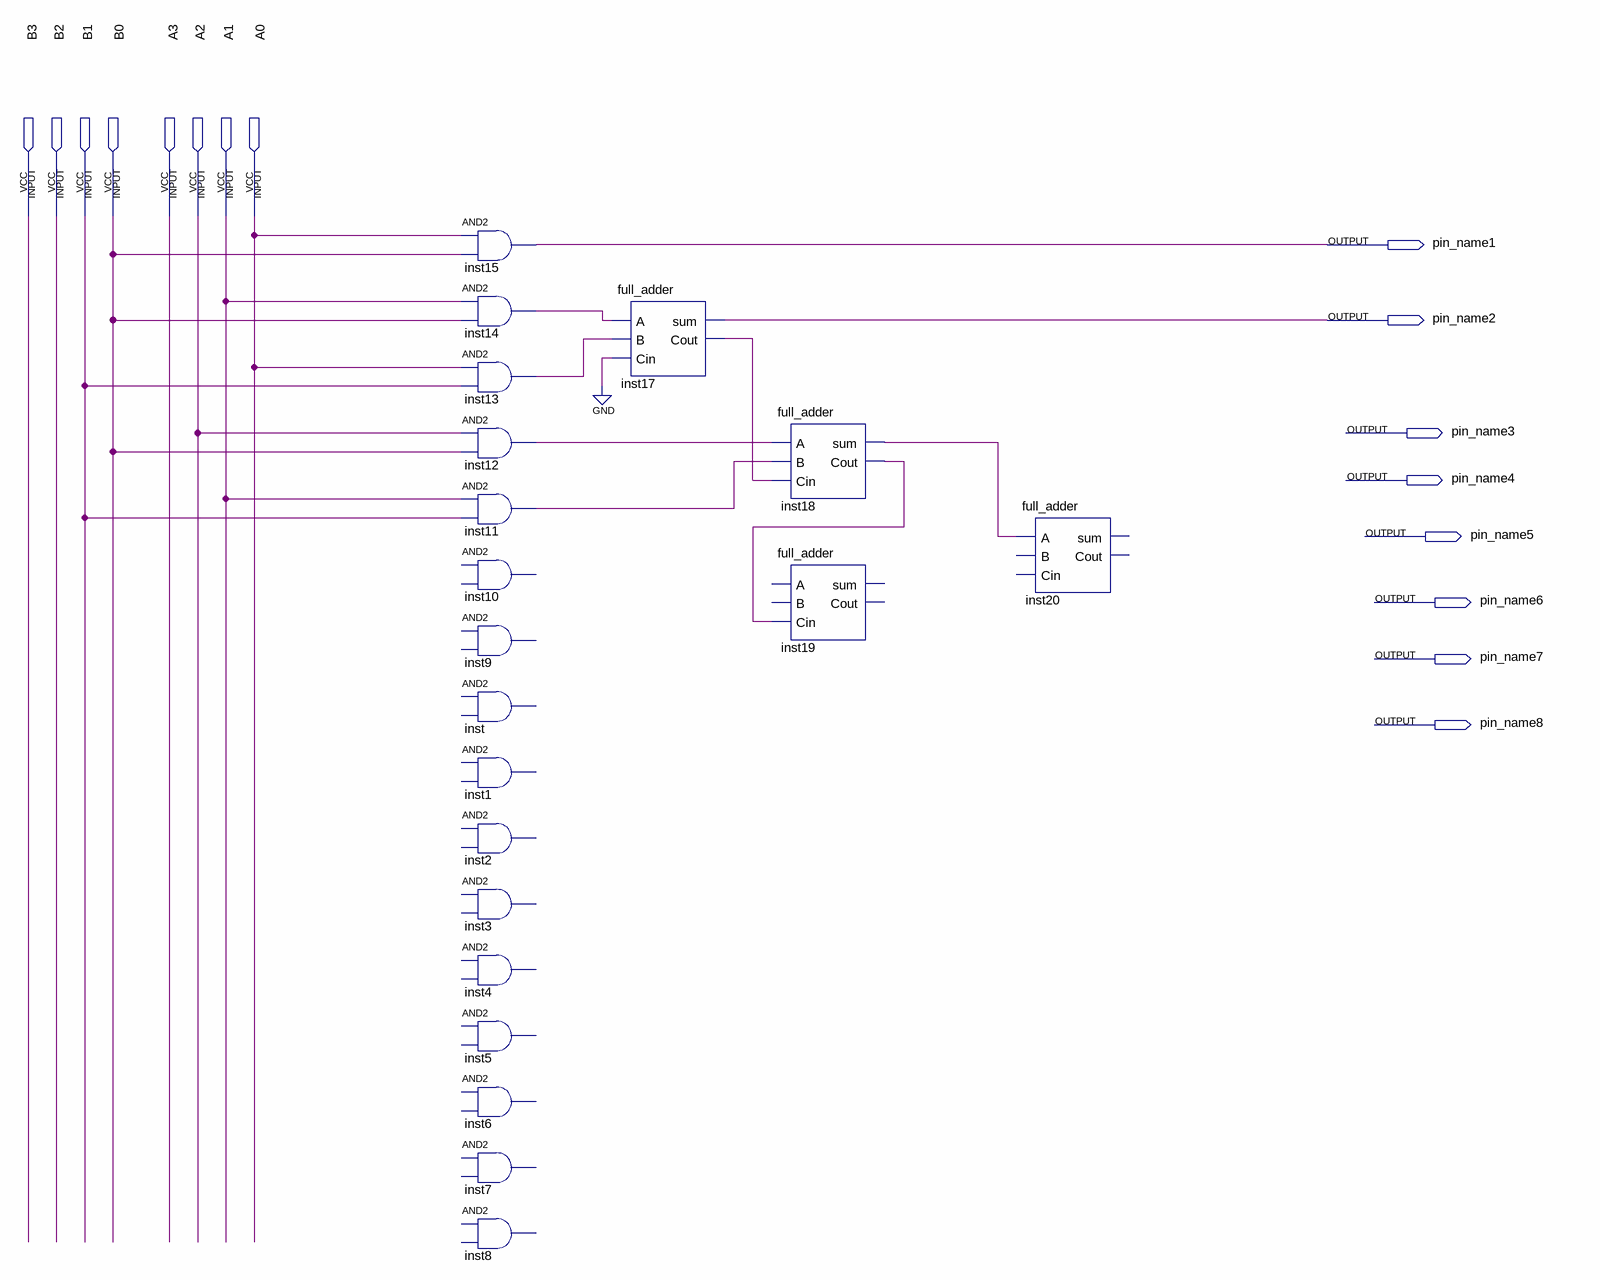
[diagram p0: schematic sheet]
// Quartus schematic multiplier4.bdf as structural Verilog: 20 symbols, 16 pins
module multiplier4 (
  input  B3,
  input  B2,
  input  B1,
  input  B0,
  input  A3,
  input  A2,
  input  A1,
  input  A0,
  output pin_name1,
  output pin_name2,
  output pin_name3,
  output pin_name4,
  output pin_name5,
  output pin_name6,
  output pin_name7,
  output pin_name8
);

  wire inst11_out, inst12_out, inst13_out, inst14_out, inst17_cout, inst18_cout, inst18_sum;

  and inst15 (pin_name1, A0, B0);
  and inst14 (inst14_out, A1, B0);
  and inst13 (inst13_out, A0, B1);
  and inst12 (inst12_out, A2, B0);
  and inst11 (inst11_out, A1, B1);
  // AND2 inst10 is placed but not wired
  // AND2 inst9 is placed but not wired
  // AND2 inst is placed but not wired
  // AND2 inst1 is placed but not wired
  // AND2 inst2 is placed but not wired
  // AND2 inst3 is placed but not wired
  // AND2 inst4 is placed but not wired
  // AND2 inst5 is placed but not wired
  // AND2 inst6 is placed but not wired
  // AND2 inst7 is placed but not wired
  // AND2 inst8 is placed but not wired
  full_adder inst17 (.A(inst14_out), .B(inst13_out), .Cin(1'b0), .sum(pin_name2), .Cout(inst17_cout));
  full_adder inst18 (.A(inst12_out), .B(inst11_out), .Cin(inst17_cout), .sum(inst18_sum), .Cout(inst18_cout));
  full_adder inst19 (.Cin(inst18_cout));  // open: A, B, sum, Cout
  full_adder inst20 (.A(inst18_sum));  // open: B, Cin, sum, Cout
endmodule
